# Altium schematic sheet LTC6811_1.SchDoc
size A4; SheetNumber: 2; SheetTotal: 5
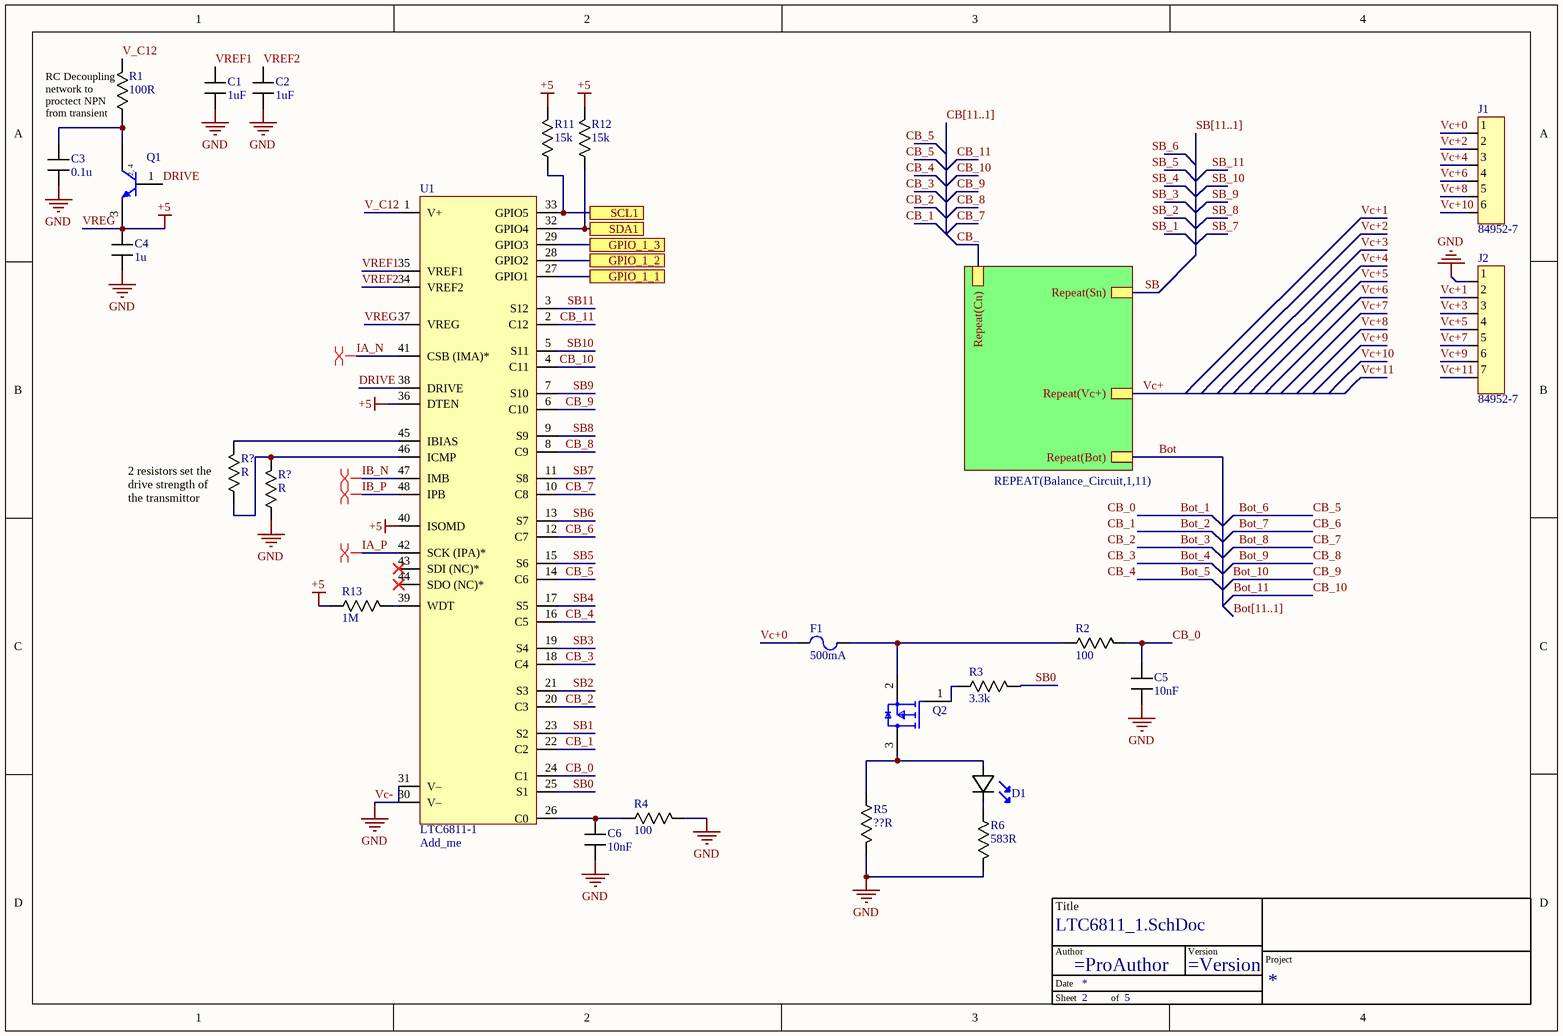
[diagram p0: LTC6811_1.SchDoc]

## Parts
(Parts that share a designator on the sheet are numbered #1, #2 ... from top to bottom, then left to right.)
*  TitleBlock  (value not drawn)  (graphical)
C1  value 1uF  [C_0603]  (hidden comment: C)
C2  value 1uF  [C_0603]  (hidden comment: C)
C3  value 0.1u  [C_0603]  (hidden comment: C)
C4  value 1u  [C_0603]  (hidden comment: C)
C5  value 10nF  [C_0603]  (hidden comment: C)
C6  value 10nF  [C_0603]  (hidden comment: C)
D1  150060BS55040  [LED (0603)]  (value not drawn)
F1  Current Rating: 500mA  [LFUS-461_V]  (hidden comment: 0461.500ER)
J1  84952-7  [84952-6]
J2  84952-7  [84952-7]
Q1  NSV1C201MZ4T1G  [ONSC-SOT-223-4-318E-04_V]  (value not drawn)
Q2  NX2301P,215  [FP-SOT23-MFG]  (value not drawn)
R1  value 100R  [R-0603]  (hidden comment: Resistor)
R2  value 100  [R-0603]  (hidden comment: Resistor)
R3  value 3.3k  [R-0603]  (hidden comment: Resistor)
R4  value 100  [R-0603]  (hidden comment: Resistor)
R5  value ??R  [R_0805]  (hidden comment: Resistor)
R6  value 583R  [R-0603]  (hidden comment: RT0603DRE07583RL)
R11  value 15k  [R-0603]  (hidden comment: Resistor)
R12  value 15k  [R-0603]  (hidden comment: Resistor)
R13  value 1M  [R-0603]  (hidden comment: Resistor)
R?#1  value R  [R-0603]  (hidden comment: Resistor)
R?#2  value R  [R-0603]  (hidden comment: Resistor)
U1  LTC6811-1  Supplier Part Number 1: Add_me  [48-Lead SSOP]

## Sub-sheets
REPEAT(Balance_Circuit,1,11) = Balance_Circuit: Repeat(Cn), Repeat(Sn), Repeat(Vc+), Repeat(Bot)

## Ports
GPIO_1_1, GPIO_1_2, GPIO_1_3, SCL1, SDA1

## Nets
Vc-: C1.1 C2.1 C3.1 C4.1 C5.1 C6.1 J2.1 R4.1 R5.2 R6.2 R?#2.1 U1.30(V–) U1.31(V–)  [also labelled GND]
VREG: C4.2 Q1.3(E) R11.2 R12.2 R13.1 U1.36(DTEN) U1.37(VREG) U1.40(ISOMD)  [also labelled +5]
Bot: sheet REPEAT(Balance_Circuit,1,11)/Repeat(Bot)
Bot_1: C5.2 R2.2 U1.24(C1)  [also labelled CB_0]
Bot_2: U1.22(C2)  [also labelled CB_1]
Bot_3: U1.20(C3)  [also labelled CB_2]
Bot_4: U1.18(C4)  [also labelled CB_3]
Bot_5: U1.16(C5)  [also labelled CB_4]
Bot_6: U1.14(C6)  [also labelled CB_5]
Bot_7: U1.12(C7)  [also labelled CB_6]
Bot_8: U1.10(C8)  [also labelled CB_7]
Bot_9: U1.8(C9)  [also labelled CB_8]
Bot_10: U1.6(C10)  [also labelled CB_9]
Bot_11: U1.4(C11)  [also labelled CB_10]
CB_: sheet REPEAT(Balance_Circuit,1,11)/Repeat(Cn)
CB_11: U1.2(C12)
DRIVE: Q1.1(B) U1.38(DRIVE)
GPIO_1_1: U1.27(GPIO1) ; port GPIO_1_1
GPIO_1_2: U1.28(GPIO2) ; port GPIO_1_2
GPIO_1_3: U1.29(GPIO3) ; port GPIO_1_3
IA_N: U1.41(CSB_(IMA)*)
IA_P: U1.42(SCK_(IPA)*)
IB_N: U1.47(IMB)
IB_P: U1.48(IPB)
SB: sheet REPEAT(Balance_Circuit,1,11)/Repeat(Sn)
SB0: R3.2 U1.25(S1)
SB1: U1.23(S2)
SB2: U1.21(S3)
SB3: U1.19(S4)
SB4: U1.17(S5)
SB5: U1.15(S6)
SB6: U1.13(S7)
SB7: U1.11(S8)
SB8: U1.9(S9)
SB9: U1.7(S10)
SB10: U1.5(S11)
SB11: U1.3(S12)
SCL1: R11.1 U1.33(GPIO5) ; port SCL1
SDA1: R12.1 U1.32(GPIO4) ; port SDA1
V_C12: R1.2 U1.1(V+)
Vc+: sheet REPEAT(Balance_Circuit,1,11)/Repeat(Vc+)
Vc+0: F1.1 J1.1
Vc+1: J2.2
Vc+2: J1.2
Vc+3: J2.3
Vc+4: J1.3
Vc+5: J2.4
Vc+6: J1.4
Vc+7: J2.5
Vc+8: J1.5
Vc+9: J2.6
Vc+10: J1.6
Vc+11: J2.7
VREF1: C1.2 U1.35(VREF1)
VREF2: C2.2 U1.34(VREF2)
NetC3_2: C3.2 Q1.2(C) Q1.4(C) R1.1
NetC6_2: C6.2 R4.2 U1.26(C0)
NetD1_1: D1.1(Cathode) R6.1
NetD1_2: D1.2(Anode) Q2.3(D) R5.1
NetF1_2: F1.2 Q2.2(S) R2.1
NetQ2_1: Q2.1(G) R3.1
NetR13_2: R13.2 U1.39(WDT)
NetR?#1_1: R?#1.1 R?#2.2 U1.46(ICMP)
NetR?#1_2: R?#1.2 U1.45(IBIAS)

Not connected (* = marked no-connect by the designer): U1 43(SDI_(NC)*)* 44(SDO_(NC)*)*

## Buses and harness runs
bus Bot[11..1]
bus CB[11..1]
bus SB[11..1]

## Layout directives
differential pair: IA_N, IA_P, IB_N, IB_P

## Notes on the sheet
- (near R1) RC Decoupling network to proctect NPN from transient
- (near R?#1) 2 resistors set the drive strength of the transmittor
- (in symbol CMP-1048-00450-1) 2, 4
- (in symbol TitleBlock) Title; Author; Version; Project; Date; Sheet; of

## Library data of the parts
C1 C2 = Capacitor: Bypass caps; ComponentLink1Description: New link; ComponentLink1URL: *
C3-C6 = Capacitor: ComponentLink1Description: New link; ComponentLink1URL: *
D1 = 150060BS55040: LED BLUE DIFFUSED 0603 SMD; Manufacturer: Wurth Electronics; Lens Style: Flat; Luminous Intensity: 80mcd; Forward Voltage: 3.2V; Test Current: 20mA; Viewing Angle: 140°; Dominant Wavelength: 470nm; Lens Size: 0.8mm; Supplier 1: RSComponents; Manufacturer Part Number: 150060BS55040; RoHS: No; Stock 1: 950; Pricing 1: 4000=0.09100, 8000=0.08800, 12000=0.08500 (USD); Mount: Surface Mount; Case/Package: 0603; Color: Blue; Packaging: Tape and Reel; Lens Transparency: Diffused; Length: 1.6mm; Width: 0.8mm; Height: 0.5mm; RoHS Compliant: No; ComponentLink1URL: http://www.farnell.com/datasheets/2621640.pdf?src-supplier=Farnell; ComponentLink1Description: http://www.farnell.com/datasheets/2621640.pdf?src-supplier=Farnell; ComponentLink2URL: https://www.we-online.de/web/en/index.php/download/media/07_electronic_components/download_center_1/application_notes_berichte/ano002_leds___the_future_of_horticultural_lighting/ANO002b_EN_LEDs_The_Future_of_Horticultural_Lighting.pdf?src-supplier=Digi-Key; ComponentLink2Description: https://www.we-online.de/web/en/index.php/download/media/07_electronic_components/download_center_1/application_notes_berichte/ano002_leds___the_future_of_horticultural_lighting/ANO002b_EN_LEDs_The_Future_of_Horticultural_Lighting.pdf?src-supplier=Digi-Key; ComponentLink3URL: https://katalog.we-online.de/pbs/datasheet/150060BS55040.pdf?src-supplier=Digi-Key; ComponentLink3Description: https://katalog.we-online.de/pbs/datasheet/150060BS55040.pdf?src-supplier=Digi-Key; ComponentLink4URL: http://www.farnell.com/datasheets/2621640.pdf?src-supplier=Newark; ComponentLink4Description: http://www.farnell.com/datasheets/2621640.pdf?src-supplier=Newark; Supplier Part Number 1: 1764994
F1 = CMP-2000-05731-1: Fuse, 600 V, 500 mA, -55 to 125 degC, 2-Pin SMD, RoHS, Tape and Reel; Manufacturer: Littelfuse; Body Material: Ceramic; Voltage Rating AC: 600V; Fuse Size / Group: TeleLink; Case Height: 3.12mm; Type: TelelinkSurgeResistantSMD/SMTFuse; Case Length: 10.1mm; Interrupt Rating: 60Ampsat600VoltsAC; Fuse Type: TimeDelay/SlowBlow; Resistance: 560mOhms; RoHS: Details; Termination Style: SMD/SMT; Manufacturer URL: http://www.littelfuse.com/; Mounting Technology: SurfaceMount; Datasheet Version: 05/2015; Factory Pack Quantity: 2500; Tradename: TeleLink; Voltage Rating: 600V; Package Reference: 461; Datasheet URL: http://www.littelfuse.com/~/media/electronics/datasheets/fuses/littelfuse_fuse_461_datasheet.pdf.pdf; Product: SurfaceMountFuses; Mounting Style: SMD/SMT; Operating Temperature Range: -55Cto+125C; Brand: Littelfuse; Case Width: 3.12mm; Dimensions: 10.1mmLx3.12mmW; Product Category: SurfaceMountFuses; Series: 461; Packaging: Reel; Product Type: SurfaceMountFuse; Package Description: 2-Pin Surface Mount Device, Body 10.1 x 3.12 mm
J1 = 84952-6: FFC / FPC Board Connector, 84952 Series, Surface Mount, Receptacle, 6, Bottom, 1 mm; Manufacturer: TE Connectivity; Body Plating: Tin; Current Rating: 1A; Number of Contacts: 6; Voltage Rating: 200V; Gender: Female; Connector Type: Receptacle,Connector,Socket; Wire/Cable Type: Flat Flex; Connector System: Flex-to-Board; Mating Alignment: Yes (With); PCB Mount Alignment: No (Without); PCB Mount Retention: With; PCB Mounting Orientation: Right Angle; Shielding: Unshielded; Pitch: 0.039inch; Plating Thickness: 2um; Pin Diameter: 0.2mm; Supplier 1: RSComponents; Manufacturer Part Number: 84952-6; RoHS: Yes; Category: FFC / FPC; Stock 1: 390; Pricing 1: 10=0.74200, 50=0.63100, 100=0.55700, 250=0.48200, 500=0.44500 (USD); Mount: Surface Mount; Contact Plating: Tin,Bright; Contact Material: Bronze; Housing Color: Natural; Housing Material: Polymer; Color: Natural; Material: Thermoplastic; Min Operating Temperature: -40°C; Max Operating Temperature: 85°C; Packaging: Tape and Reel; Package Quantity: 1500; Termination: SMD/SMT; Number of Rows: 1; Orientation: Right Angle; Number of Positions: 6; Series: 84952; Sealable: No (Without); Shrouded: Yes (With); Contact Current Rating: 1A; Contact Location: Bottom; Max Voltage Rating (AC): 200V; Length: 13.92mm; Width: 0.2575inch; Height: 2.56mm; Depth: 6.54mm; Lead Pitch: 1mm; Radiation Hardening: No; Flammability Rating: UL94 V-0; REACH SVHC: No SVHC; ELV: Compliant; ComponentLink1URL: https://datasheet.ciiva.com/11745/0900766b806b3b1b-11745221.pdf?src-supplier=RSComponents; ComponentLink1Description: https://datasheet.ciiva.com/11745/0900766b806b3b1b-11745221.pdf?src-supplier=RSComponents; ComponentLink2URL: https://datasheet.ciiva.com/669/eng-cd-84952-a4-669094.pdf?src-supplier=Digi-Key; ComponentLink2Description: https://datasheet.ciiva.com/669/eng-cd-84952-a4-669094.pdf?src-supplier=Digi-Key; ComponentLink3URL: https://datasheet.ciiva.com/669/eng-cd-84952-a4-669095.pdf?src-supplier=Digi-Key; ComponentLink3Description: https://datasheet.ciiva.com/669/eng-cd-84952-a4-669095.pdf?src-supplier=Digi-Key; ComponentLink4URL: https://datasheet.ciiva.com/669/eng-cd-84952-a4-669096.pdf?src-supplier=Digi-Key; ComponentLink4Description: https://datasheet.ciiva.com/669/eng-cd-84952-a4-669096.pdf?src-supplier=Digi-Key; ComponentLink5URL: https://datasheet.ciiva.com/30235/eng-ds-1-1773440-6-0506-30235994.pdf?src-supplier=Onlinecomponents.com; ComponentLink5Description: https://datasheet.ciiva.com/30235/eng-ds-1-1773440-6-0506-30235994.pdf?src-supplier=Onlinecomponents.com; ComponentLink6URL: https://datasheet.ciiva.com/46396/315889-46396855.pdf?src-supplier=Element14; ComponentLink6Description: https://datasheet.ciiva.com/46396/315889-46396855.pdf?src-supplier=Element14; ComponentLink7URL: https://datasheet.ciiva.com/26934/getdatasheetpartid-475296-26934629.pdf?src-supplier=Verical; ComponentLink7Description: https://datasheet.ciiva.com/26934/getdatasheetpartid-475296-26934629.pdf?src-supplier=Verical; Supplier Part Number 1: 5351583
J2 = 84952-7: 1MM FPC HORZ.BTTM CONT.ASS.7P; Manufacturer: TE Connectivity; Current Rating: 1A; Number of Contacts: 7; Shielding: Unshielded; Voltage Rating: 200V; Gender: Receptacle; Connector Type: Receptacle,Connector,Socket; Wire/Cable Type: Flat Flex; Connector System: Flex-to-Board; Mating Alignment: Yes (With); PCB Mount Alignment: No (Without); PCB Mount Retention: With; PCB Mounting Orientation: Right Angle; Pitch: 0.039inch; Plating Thickness: 2um; Supplier 1: Mouser; Manufacturer Part Number: 84952-7; RoHS: Yes; Category: FFC / FPC; Stock 1: 8503; Pricing 1: 1=1.51000, 10=1.24000, 50=1.24000, 100=1.18000, 1000=0.84000, 10000=0.80000 (USD); Mount: Surface Mount; Contact Plating: Tin,Bright; Contact Material: Bronze; Housing Color: Natural; Housing Material: Polymer; Min Operating Temperature: -40°C; Max Operating Temperature: 85°C; Packaging: Tape and Reel; Package Quantity: 1500; Number of Rows: 1; Termination: SMD/SMT; Orientation: Right Angle; Series: FPC; Number of Positions: 7; Sealable: No (Without); Shrouded: Yes (With); Contact Current Rating: 1A; Max Voltage Rating (AC): 200V; Length: 0.5866inch; Width: 0.2575inch; Height: 2.56mm; Depth: 6.54mm; Radiation Hardening: No; ELV: Compliant; REACH SVHC: Unknown; Supplier Part Number 1: 571-84952-7
Q1 = CMP-1048-00450-1: 100 V, 2 A, Low VCE(sat), NPN Transistor, 4-Pin SOT-223, Pb-Free, Tape and Reel; Manufacturer: On Semiconductor; IC Continuous (A): 2; Note1: 0; PackageReference: SOT-223-4-318E-04; Polarity: NPN; ComponentLink3URL: http://www.onsemi.com/pub_link/Collateral/318E-04.PDF; RoHS: TRUE; PackageDescription: 4-Pin Small Outline Transistor, Body 6.5 x 3.5 mm, Pitch 2.3 mm; DatasheetVersion: Rev. 4; Mounting Technology: Surface Mount; ComponentLink1Description: Manufacturer URL; ComponentLink1URL: http://www.onsemi.com/; PackageVersion: Rev. N, 08/2009; ComponentLink2Description: Datasheet; Packing: Tape and Reel; ComponentLink2URL: http://www.onsemi.cn/pub_link/Collateral/NSS1C201MZ4-D.PDF; ComponentLink3Description: Package Specification; PartNumber: NSV1C201MZ4T1G
Q2 = CMP-14409-000018-1: MOSFET P-CH 20V 2A TO-236AB
R1 = Resistor: Power supply resistor
R5 = Resistor: Balance Resistor
R6 = Resistor: High Precision-High Stability Chip Resistor Thin Film 0603 583Ohm 0.5% Paper T/R; Manufacturer: Yageo; Max Power Dissipation: 100mW; Temperature Coefficient: 50ppm/°C; Supplier 1: Mouser; Supplier Part Number 1: 603-RT0603DRE07583RL; Manufacturer Part Number: RT0603DRE07583RL; RoHS: Yes; Category: Chip SMD Resistors; Stock 1: 17347; Pricing 1: 1=0.14000, 10=0.07400, 50=0.07400, 100=0.02600, 1000=0.01900, 10000=0.01200 (USD); Case/Package: 0603; Min Operating Temperature: -55°C; Max Operating Temperature: 155°C; Resistor Type: Thin Film; Packaging: Tape and Reel; Number of Terminations: 2; Resistance: 583R; Tolerance: 0.5%; ComponentLink1URL: http://www.yageo.com/documents/recent/PYu-RT_1-to-0.01_RoHS_L_9.pdf?src-supplier=Digi-Key; ComponentLink1Description: http://www.yageo.com/documents/recent/PYu-RT_1-to-0.01_RoHS_L_9.pdf?src-supplier=Digi-Key
R11 R12 = Resistor: I2C Pullup
U1 = LTC6811-1: IC MONITOR BATT STACK 48SSOP; Manufacturer: Analog Devices / Linear Technology; Supplier 1: Mouser; Manufacturer Part Number: LTC6811-1; RoHS: Yes; Category: Battery Management; Case/Package: SSOP; RoHS Compliant: Yes; ComponentLink1URL: http://www.linear.com/docs/55980?src-supplier=Digi-Key; ComponentLink1Description: http://www.linear.com/docs/55980?src-supplier=Digi-Key